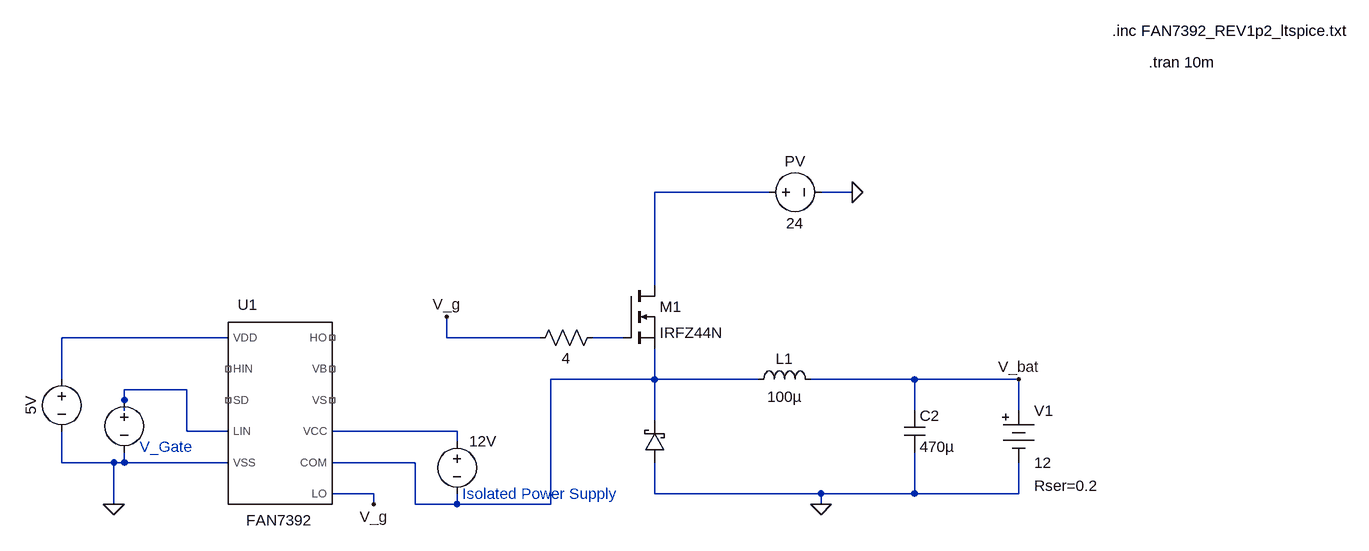
[diagram p0: schematic isolated power supply.asc]
isolated power supply.asc, the LTspice schematic file:
Version 4
SHEET 1 4320 680
WIRE 960 -176 784 -176
WIRE 1088 -176 1040 -176
WIRE 784 -32 784 -176
WIRE 128 48 -128 48
WIRE 464 48 464 16
WIRE 608 48 464 48
WIRE 736 48 688 48
WIRE -128 112 -128 48
WIRE 784 112 784 64
WIRE 784 112 624 112
WIRE 944 112 784 112
WIRE 1184 112 1024 112
WIRE 1344 112 1184 112
WIRE 64 128 -32 128
WIRE -32 144 -32 128
WIRE -32 160 -32 144
WIRE 1184 160 1184 112
WIRE 1344 160 1344 112
WIRE 784 176 784 112
WIRE 64 192 64 128
WIRE 128 192 64 192
WIRE 480 192 288 192
WIRE 480 208 480 192
WIRE -128 240 -128 192
WIRE -48 240 -128 240
WIRE -32 240 -32 224
WIRE -32 240 -48 240
WIRE 128 240 -32 240
WIRE 416 240 288 240
WIRE 352 288 288 288
WIRE 784 288 784 240
WIRE 1040 288 784 288
WIRE 1184 288 1184 224
WIRE 1184 288 1040 288
WIRE 1344 288 1344 240
WIRE 1344 288 1184 288
WIRE -48 304 -48 240
WIRE 352 304 352 288
WIRE 416 304 416 240
WIRE 480 304 480 288
WIRE 480 304 416 304
WIRE 624 304 624 112
WIRE 624 304 480 304
WIRE 1040 304 1040 288
FLAG 1088 -176 0
FLAG 1040 304 0
FLAG 1344 112 V_bat
FLAG 352 304 V_g
FLAG 464 16 V_g
FLAG -48 304 0
SYMBOL Gate\ drivers\\FAN7392 208 160 R0
SYMATTR InstName U1
SYMBOL ind 928 128 R270
WINDOW 0 32 56 VTop 2
WINDOW 3 5 56 VBottom 2
SYMATTR InstName L1
SYMATTR Value 100µ
SYMBOL voltage 944 -176 R270
WINDOW 0 32 56 VTop 2
WINDOW 3 -32 56 VBottom 2
WINDOW 123 0 0 Left 0
WINDOW 39 0 0 Left 0
SYMATTR InstName PV
SYMATTR Value 24
SYMBOL voltage -128 96 R0
WINDOW 0 32 56 Invisible 2
WINDOW 3 -32 56 VBottom 2
WINDOW 123 0 0 Left 0
WINDOW 39 0 0 Left 0
SYMATTR InstName V3
SYMATTR Value 5V
SYMBOL voltage -32 128 R0
WINDOW 0 24 16 Invisible 2
WINDOW 3 24 96 Invisible 2
WINDOW 123 0 0 Left 0
WINDOW 39 0 0 Left 0
SYMATTR InstName V4
SYMATTR Value PULSE(0 5v 1n 1n 1n 13u 20u)
SYMBOL cap 1168 160 R0
SYMATTR InstName C2
SYMATTR Value 470µ
SYMBOL schottky 800 240 R180
WINDOW 0 24 64 Invisible 2
WINDOW 3 24 0 Invisible 2
SYMATTR InstName D2
SYMATTR Value RBR5LAM60A
SYMATTR Description Diode
SYMATTR Type diode
SYMBOL Misc\\battery 1344 144 R0
WINDOW 123 0 0 Left 0
WINDOW 39 24 132 Left 2
SYMATTR SpiceLine Rser=0.2
SYMATTR InstName V1
SYMATTR Value 12
SYMBOL nmos 736 -32 R0
SYMATTR InstName M1
SYMATTR Value IRFZ44N
SYMBOL res 704 32 R90
WINDOW 0 0 56 Invisible 2
WINDOW 3 32 56 VTop 2
SYMATTR InstName R2
SYMATTR Value 4
SYMBOL voltage 480 192 R0
WINDOW 0 24 16 Invisible 2
WINDOW 123 0 0 Left 0
WINDOW 39 0 0 Left 0
WINDOW 3 19 15 Left 2
SYMATTR InstName V5
SYMATTR Value 12V
TEXT 1488 -424 Left 2 !.inc FAN7392_REV1p2_ltspice.txt
TEXT 1544 -376 Left 2 !.tran 10m
TEXT 488 288 Left 2 ;Isolated Power Supply
TEXT -8 216 Left 2 ;V_Gate

The netlist it stands for:
* isolated power supply.asc
XU1 N006 N004 NC_01 N005 N002 NC_02 NC_03 NC_04 0 NC_05 V_g FAN7392  ; pins VCC COM HIN LIN VDD VB VS HO VSS SD LO
L1 N004 V_bat 100µ
V§PV N001 0 24
V3 N002 0 5V
V4 N005 0 PULSE(0 5v 1n 1n 1n 13u 20u)
C2 V_bat 0 470µ
D2 0 N004 RBR5LAM60A
V1 V_bat 0 12 Rser=0.2
M1 N001 N003 N004 N004 IRFZ44N
R2 N003 V_g 4
V5 N006 N004 12V
.model D D
.lib standard.dio
.model NMOS NMOS
.model PMOS PMOS
.lib standard.mos
.inc FAN7392_REV1p2_ltspice.txt
.tran 10m
* Isolated Power Supply
* V_Gate
.backanno
.end